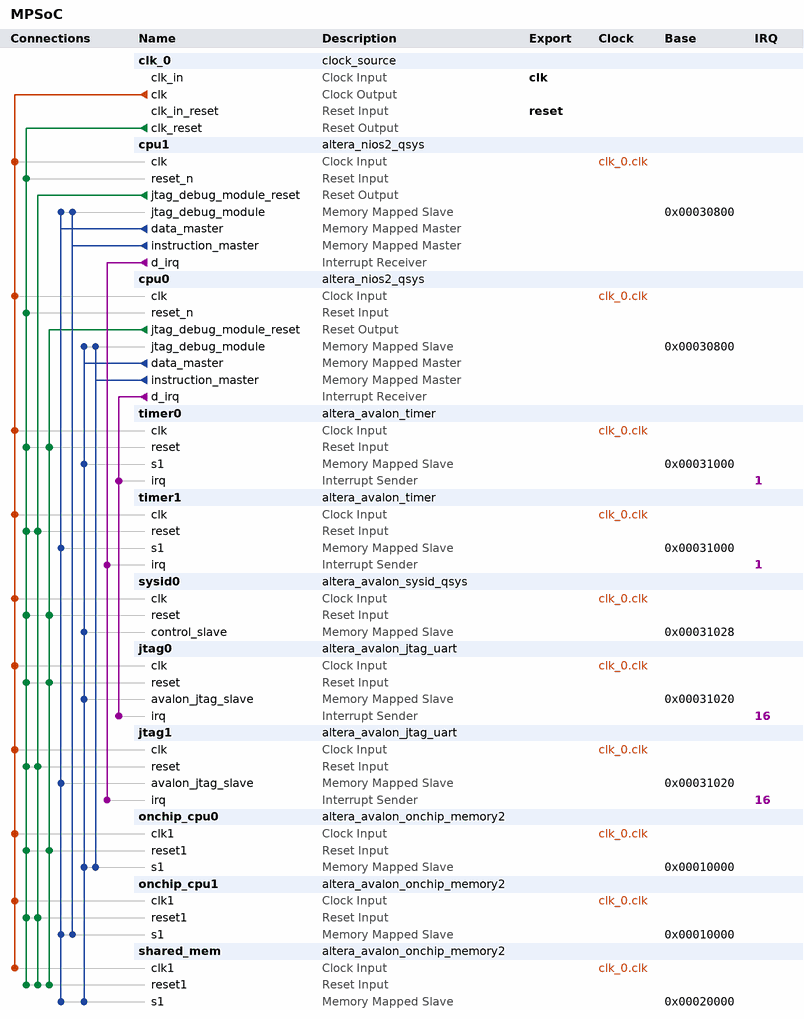
[diagram p0: system contents]
# Platform Designer (Qsys) system MPSoC, Cyclone IV E EP4CE115F29C7
# Parameters at their usual value, and those the tool derives, are not listed.
package require -exact qsys 13.1
create_system MPSoC
set_project_property DEVICE_FAMILY {Cyclone IV E}
set_project_property DEVICE EP4CE115F29C7

add_instance clk_0 clock_source 13.1
set_instance_parameter_value clk_0 clockFrequency 50000000

add_instance cpu1 altera_nios2_qsys 13.1
set_instance_parameter_value cpu1 resetSlave onchip_cpu1.s1
set_instance_parameter_value cpu1 mmu_TLBMissExcSlave None
set_instance_parameter_value cpu1 exceptionSlave onchip_cpu1.s1
set_instance_parameter_value cpu1 breakSlave cpu1.jtag_debug_module
set_instance_parameter_value cpu1 impl Tiny
set_instance_parameter_value cpu1 icache_size 4096

add_instance cpu0 altera_nios2_qsys 13.1
set_instance_parameter_value cpu0 resetSlave onchip_cpu0.s1
set_instance_parameter_value cpu0 mmu_TLBMissExcSlave None
set_instance_parameter_value cpu0 exceptionSlave onchip_cpu0.s1
set_instance_parameter_value cpu0 breakSlave cpu0.jtag_debug_module
set_instance_parameter_value cpu0 impl Tiny
set_instance_parameter_value cpu0 icache_size 4096

add_instance timer0 altera_avalon_timer 13.1
set_instance_parameter_value timer0 period 1
set_instance_parameter_value timer0 periodUnits MSEC

add_instance timer1 altera_avalon_timer 13.1
set_instance_parameter_value timer1 period 1
set_instance_parameter_value timer1 periodUnits MSEC

add_instance sysid0 altera_avalon_sysid_qsys 13.1
set_instance_parameter_value sysid0 id 0

add_instance jtag0 altera_avalon_jtag_uart 13.1
set_instance_parameter_value jtag0 simInteractiveOptions NO_INTERACTIVE_WINDOWS

add_instance jtag1 altera_avalon_jtag_uart 13.1
set_instance_parameter_value jtag1 simInteractiveOptions NO_INTERACTIVE_WINDOWS

add_instance onchip_cpu0 altera_avalon_onchip_memory2 13.1
set_instance_parameter_value onchip_cpu0 dataWidth 32
set_instance_parameter_value onchip_cpu0 dualPort false
set_instance_parameter_value onchip_cpu0 initMemContent true
set_instance_parameter_value onchip_cpu0 initializationFileName onchip_mem.hex
set_instance_parameter_value onchip_cpu0 memorySize 65536

add_instance onchip_cpu1 altera_avalon_onchip_memory2 13.1
set_instance_parameter_value onchip_cpu1 dataWidth 32
set_instance_parameter_value onchip_cpu1 dualPort false
set_instance_parameter_value onchip_cpu1 initMemContent true
set_instance_parameter_value onchip_cpu1 initializationFileName onchip_mem.hex
set_instance_parameter_value onchip_cpu1 memorySize 65536

add_instance shared_mem altera_avalon_onchip_memory2 13.1
set_instance_parameter_value shared_mem dataWidth 32
set_instance_parameter_value shared_mem dualPort false
set_instance_parameter_value shared_mem initMemContent true
set_instance_parameter_value shared_mem initializationFileName onchip_mem.hex
set_instance_parameter_value shared_mem memorySize 40000

# connections
add_connection clk_0.clk cpu0.clk clock
add_connection clk_0.clk cpu1.clk clock
add_connection clk_0.clk jtag0.clk clock
add_connection clk_0.clk jtag1.clk clock
add_connection clk_0.clk onchip_cpu0.clk1 clock
add_connection clk_0.clk onchip_cpu1.clk1 clock
add_connection clk_0.clk shared_mem.clk1 clock
add_connection clk_0.clk sysid0.clk clock
add_connection clk_0.clk timer0.clk clock
add_connection clk_0.clk timer1.clk clock
add_connection clk_0.clk_reset cpu0.reset_n reset
add_connection clk_0.clk_reset cpu1.reset_n reset
add_connection clk_0.clk_reset jtag0.reset reset
add_connection clk_0.clk_reset jtag1.reset reset
add_connection clk_0.clk_reset onchip_cpu0.reset1 reset
add_connection clk_0.clk_reset onchip_cpu1.reset1 reset
add_connection clk_0.clk_reset shared_mem.reset1 reset
add_connection clk_0.clk_reset sysid0.reset reset
add_connection clk_0.clk_reset timer0.reset reset
add_connection clk_0.clk_reset timer1.reset reset
add_connection cpu0.jtag_debug_module_reset jtag0.reset reset
add_connection cpu0.jtag_debug_module_reset onchip_cpu0.reset1 reset
add_connection cpu0.jtag_debug_module_reset shared_mem.reset1 reset
add_connection cpu0.jtag_debug_module_reset sysid0.reset reset
add_connection cpu0.jtag_debug_module_reset timer0.reset reset
add_connection cpu1.jtag_debug_module_reset jtag1.reset reset
add_connection cpu1.jtag_debug_module_reset onchip_cpu1.reset1 reset
add_connection cpu1.jtag_debug_module_reset shared_mem.reset1 reset
add_connection cpu1.jtag_debug_module_reset timer1.reset reset
add_connection cpu0.data_master cpu0.jtag_debug_module avalon
set_connection_parameter_value cpu0.data_master/cpu0.jtag_debug_module baseAddress 0x00030800
add_connection cpu0.data_master jtag0.avalon_jtag_slave avalon
set_connection_parameter_value cpu0.data_master/jtag0.avalon_jtag_slave baseAddress 0x00031020
add_connection cpu0.data_master onchip_cpu0.s1 avalon
set_connection_parameter_value cpu0.data_master/onchip_cpu0.s1 baseAddress 0x00010000
add_connection cpu0.data_master shared_mem.s1 avalon
set_connection_parameter_value cpu0.data_master/shared_mem.s1 baseAddress 0x00020000
add_connection cpu0.data_master sysid0.control_slave avalon
set_connection_parameter_value cpu0.data_master/sysid0.control_slave baseAddress 0x00031028
add_connection cpu0.data_master timer0.s1 avalon
set_connection_parameter_value cpu0.data_master/timer0.s1 baseAddress 0x00031000
add_connection cpu0.instruction_master cpu0.jtag_debug_module avalon
set_connection_parameter_value cpu0.instruction_master/cpu0.jtag_debug_module baseAddress 0x00030800
add_connection cpu0.instruction_master onchip_cpu0.s1 avalon
set_connection_parameter_value cpu0.instruction_master/onchip_cpu0.s1 baseAddress 0x00010000
add_connection cpu1.data_master cpu1.jtag_debug_module avalon
set_connection_parameter_value cpu1.data_master/cpu1.jtag_debug_module baseAddress 0x00030800
add_connection cpu1.data_master jtag1.avalon_jtag_slave avalon
set_connection_parameter_value cpu1.data_master/jtag1.avalon_jtag_slave baseAddress 0x00031020
add_connection cpu1.data_master onchip_cpu1.s1 avalon
set_connection_parameter_value cpu1.data_master/onchip_cpu1.s1 baseAddress 0x00010000
add_connection cpu1.data_master shared_mem.s1 avalon
set_connection_parameter_value cpu1.data_master/shared_mem.s1 baseAddress 0x00020000
add_connection cpu1.data_master timer1.s1 avalon
set_connection_parameter_value cpu1.data_master/timer1.s1 baseAddress 0x00031000
add_connection cpu1.instruction_master cpu1.jtag_debug_module avalon
set_connection_parameter_value cpu1.instruction_master/cpu1.jtag_debug_module baseAddress 0x00030800
add_connection cpu1.instruction_master onchip_cpu1.s1 avalon
set_connection_parameter_value cpu1.instruction_master/onchip_cpu1.s1 baseAddress 0x00010000
add_connection cpu0.d_irq jtag0.irq interrupt
set_connection_parameter_value cpu0.d_irq/jtag0.irq irqNumber 16
add_connection cpu0.d_irq timer0.irq interrupt
set_connection_parameter_value cpu0.d_irq/timer0.irq irqNumber 1
add_connection cpu1.d_irq jtag1.irq interrupt
set_connection_parameter_value cpu1.d_irq/jtag1.irq irqNumber 16
add_connection cpu1.d_irq timer1.irq interrupt
set_connection_parameter_value cpu1.d_irq/timer1.irq irqNumber 1

# exported interfaces
add_interface clk clock sink
set_interface_property clk EXPORT_OF clk_0.clk_in
add_interface reset reset sink
set_interface_property reset EXPORT_OF clk_0.clk_in_reset

set_interconnect_requirement {$system} qsys_mm.clockCrossingAdapter HANDSHAKE
set_interconnect_requirement {$system} qsys_mm.maxAdditionalLatency 1
set_interconnect_requirement {$system} qsys_mm.insertDefaultSlave false

save_system MPSoC.qsys
